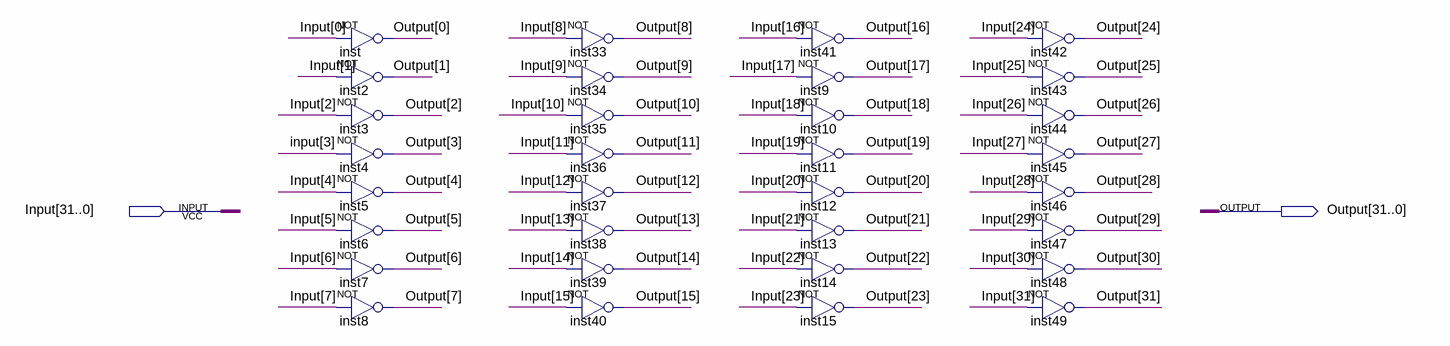
[diagram p0: schematic sheet]
// Quartus schematic 32BitNot.bdf as structural Verilog: 32 symbols, 2 pins
module \32BitNot  (
  input  [31:0] Input,
  output [31:0] Output
);

  not inst (Output[0], Input[0]);
  not inst2 (Output[1], Input[1]);
  not inst3 (Output[2], Input[2]);
  not inst4 (Output[3], Input[3]);
  not inst5 (Output[4], Input[4]);
  not inst6 (Output[5], Input[5]);
  not inst7 (Output[6], Input[6]);
  not inst8 (Output[7], Input[7]);
  not inst33 (Output[8], Input[8]);
  not inst34 (Output[9], Input[9]);
  not inst35 (Output[10], Input[10]);
  not inst36 (Output[11], Input[11]);
  not inst37 (Output[12], Input[12]);
  not inst38 (Output[13], Input[13]);
  not inst39 (Output[14], Input[14]);
  not inst40 (Output[15], Input[15]);
  not inst41 (Output[16], Input[16]);
  not inst9 (Output[17], Input[17]);
  not inst10 (Output[18], Input[18]);
  not inst11 (Output[19], Input[19]);
  not inst12 (Output[20], Input[20]);
  not inst13 (Output[21], Input[21]);
  not inst14 (Output[22], Input[22]);
  not inst15 (Output[23], Input[23]);
  not inst42 (Output[24], Input[24]);
  not inst43 (Output[25], Input[25]);
  not inst44 (Output[26], Input[26]);
  not inst45 (Output[27], Input[27]);
  not inst46 (Output[28], Input[28]);
  not inst47 (Output[29], Input[29]);
  not inst48 (Output[30], Input[30]);
  not inst49 (Output[31], Input[31]);
endmodule
